# Altium schematic sheet uC_Interface.SchDoc
size A4; SheetNumber: 5; SheetTotal: 9
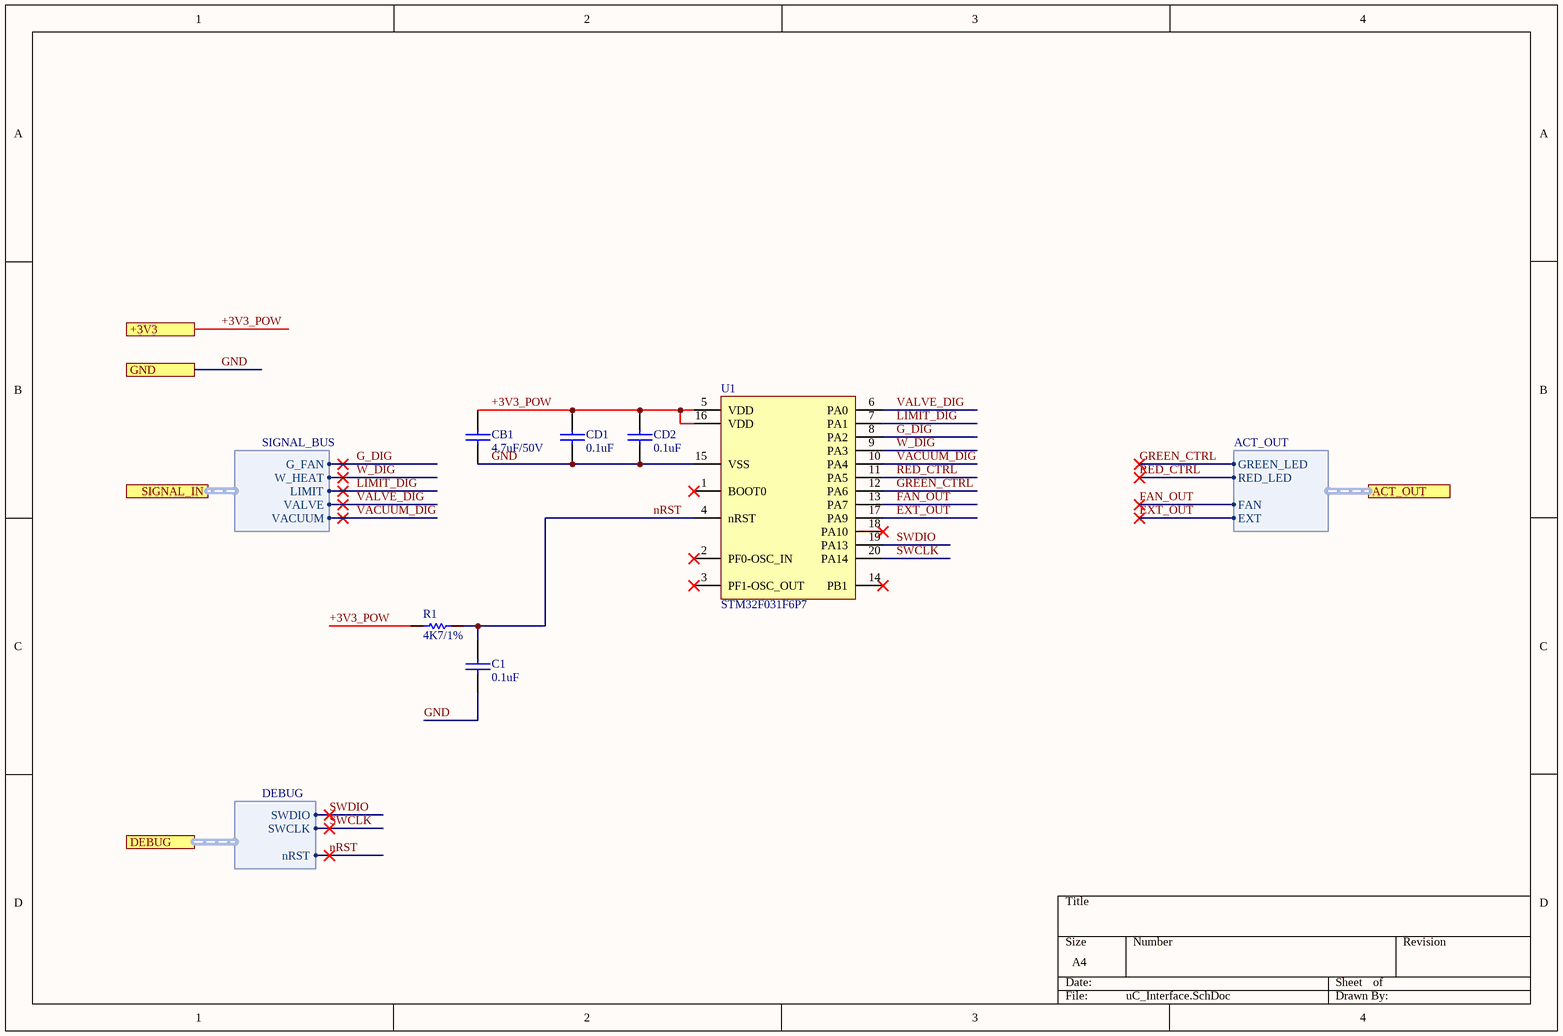
[diagram p0: uC_Interface.SchDoc]

## Parts
C1  0.1uF  [1206-CAP-TDK]
CB1  4.7uF/50V  [1206-CAP-TDK]
CD1  0.1uF  [1206-CAP-TDK]
CD2  0.1uF  [1206-CAP-TDK]
R1  4K7/1%  [1206-RES-PANASONIC]
U1  STM32F031F6P7  [ST-TSSOP-20 - STM32F031F6P7]

## Ports
+3V3, ACT_OUT (harness ACT_OUT), DEBUG (harness DEBUG), GND, SIGNAL_IN (harness SIGNAL_BUS)

## Harnesses
SIGNAL_BUS: G_FAN, LIMIT, VACUUM, VALVE, W_HEAT
ACT_OUT: GREEN_LED, RED_LED, FAN, EXT
DEBUG: SWDIO, SWCLK, nRST

## Nets
+3V3_POW: CB1.2 CD1.2 CD2.2 R1.1 U1.5(VDD) U1.16(VDD) ; port +3V3
EXT_OUT: U1.17(PA9) ; port ACT_OUT.EXT
FAN_OUT: U1.13(PA7) ; port ACT_OUT.FAN
G_DIG: U1.8(PA2) ; port SIGNAL_IN.G_FAN
GND: C1.1 CB1.1 CD1.1 CD2.1 U1.15(VSS) ; port GND
GREEN_CTRL: U1.12(PA6) ; port ACT_OUT.GREEN_LED
LIMIT_DIG: U1.7(PA1) ; port SIGNAL_IN.LIMIT
nRST: C1.2 R1.2 U1.4(nRST) ; port DEBUG.nRST
RED_CTRL: U1.11(PA5) ; port ACT_OUT.RED_LED
SWCLK: U1.20(PA14) ; port DEBUG.SWCLK
SWDIO: U1.19(PA13) ; port DEBUG.SWDIO
VACUUM_DIG: U1.10(PA4) ; port SIGNAL_IN.VACUUM
VALVE_DIG: U1.6(PA0) ; port SIGNAL_IN.VALVE
W_DIG: U1.9(PA3) ; port SIGNAL_IN.W_HEAT

Not connected (* = marked no-connect by the designer): U1 1(BOOT0)* 2(PF0-OSC_IN)* 3(PF1-OSC_OUT)* 14(PB1)* 18(PA10)*

## Library data of the parts
C1 CB1 CD1 CD2 = CAP-SMD
  C1 CD1 CD2: JLCPart: C24497
  CB1: JLCPart: C29823
R1 = RES-SMD: JLCPart: C17936
U1 = STM32F031F6P7: ARM® Cortex®-M0 STM32F0 Microcontroller IC 32-Bit Single-Core 48MHz 32KB (32K x 8) FLASH 20-TSSOP; JLCPart: C117472